# EAGLE design Sensor PCB (EAGLE 9.6.1)
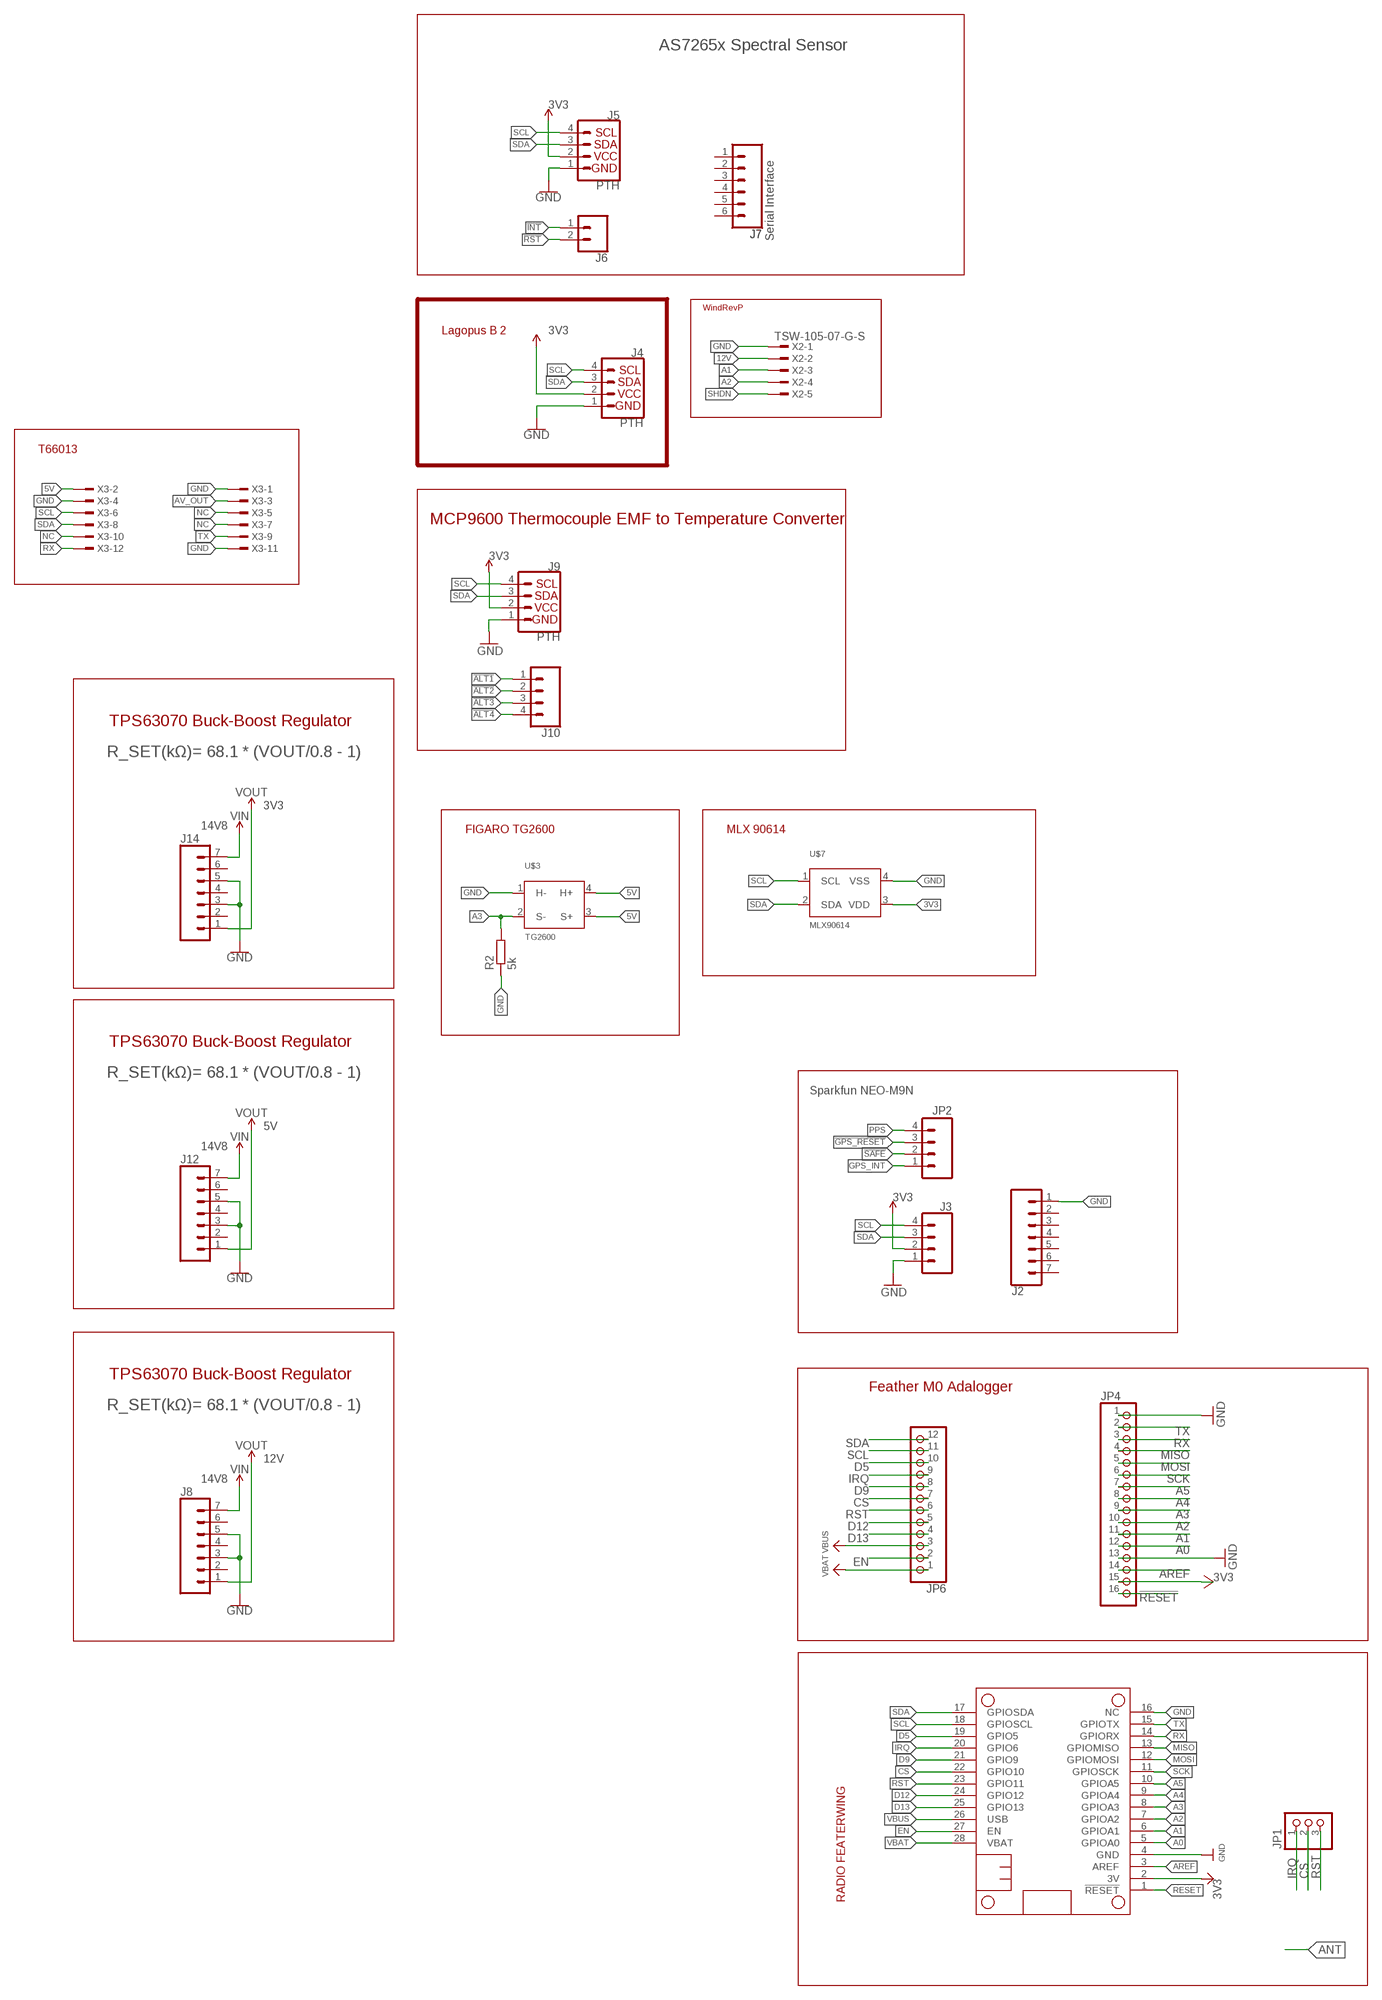
[diagram p0: schematic, sheet 1]

## Parts
J2  CONN_07NO_SILK  [1X07_NO_SILK]
J3  CONN_041X04_NO_SILK  [1X04_NO_SILK]
J4  PTH  I2C_STANDARD_NO_SILK  [1X04_NO_SILK]
J5  PTH  I2C_STANDARD_NO_SILK  [1X04_NO_SILK]
J6  CONN_021X02_NO_SILK  [1X02_NO_SILK]
J7  Serial Interface  CONN_06NO_SILK_FEMALE_PTH  [1X06_NO_SILK]
J8  CONN_07NO_SILK  [1X07_NO_SILK]
J9  PTH  I2C_STANDARD_NO_SILK  [1X04_NO_SILK]
J10  CONN_041X04_NO_SILK  [1X04_NO_SILK]
J12  CONN_07NO_SILK  [1X07_NO_SILK]
J14  CONN_07NO_SILK  [1X07_NO_SILK]
JP1  HEADER-1X376MIL  [1X03_ROUND_76]
JP2  CONN_041X04_NO_SILK  [1X04_NO_SILK]
JP4  HEADER-1X16ROUND  [1X16_ROUND]
JP6  HEADER-1X12  [1X12_ROUND]
MS2  FEATHERWING_NOHOLES  [FEATHERWING_NOHOLES]
R2  5k  R-EU_0207/7  [0207/7]
U$3  TG2600  [TO-5]
U$7  MLX90614  [TO-39]
X2  TSW-105-07-G-S  [TSW-105-XX-G-S]
X3  TSW-106-07-G-D  [TSW-106-XX-G-D]

## Nets
3V3: J3.2 J4.2(VCC) J5.2 J9.2 J14.1 JP4.15 MS2.2(3V) U$7.3(VDD) ; supply symbol labelled 3.3V, +3V3, VOUT
5V: J12.1 U$3.3(S+) U$3.4(H+) X3.2 ; supply symbol labelled VOUT
12V: J8.1 X2.2 ; supply symbol labelled VOUT
14V8: J8.7 J12.7 J14.7 ; supply symbol labelled VIN
!ALT1: J10.1
!ALT2: J10.2
!ALT3: J10.3
!ALT4: J10.4
!GPS_RESET: JP2.3
!INT: J6.1
!RESET: JP4.16
!RST: J6.2
!SAFE: JP2.2
A0: JP4.12 MS2.5(GPIOA0)
A1: JP4.11 MS2.6(GPIOA1) X2.3
A2: JP4.10 MS2.7(GPIOA2) X2.4
A3: JP4.9 MS2.8(GPIOA3) R2.2 U$3.2(S-)
A4: JP4.8 MS2.9(GPIOA4)
A5: JP4.7 MS2.10(GPIOA5)
AREF: JP4.14 MS2.3(AREF)
AV_OUT: X3.3
CS: JP1.2 JP6.7 MS2.22(GPIO10)
D5: JP6.10 MS2.19(GPIO5)
D9: JP6.8 MS2.21(GPIO9)
D12: JP6.5 MS2.24(GPIO12)
D13: JP6.4 MS2.25(GPIO13)
EN: JP6.2 MS2.27(EN)
GND: J2.1 J3.1 J4.1(GND) J5.1 J8.3 J8.5 J9.1 J12.3 J12.5 J14.3 J14.5 JP4.1 JP4.13 MS2.4(GND) MS2.16(NC) R2.1 U$3.1(H-) U$7.4(VSS) X2.1 X3.1 X3.4 X3.11
GPS_INT: JP2.1
IRQ: JP1.1 JP6.9 MS2.20(GPIO6)
MISO: JP4.4 MS2.13(GPIOMISO)
MOSI: JP4.5 MS2.12(GPIOMOSI)
NC: X3.5 X3.7 X3.10
PPS: JP2.4
RESET: MS2.1(!RESET)
RST: JP1.3 JP6.6 MS2.23(GPIO11)
RX: JP4.3 MS2.14(GPIORX) X3.12
SCK: JP4.6 MS2.11(GPIOSCK)
SCL: J3.4 J4.4(SCL) J5.4 J9.4 JP6.11 MS2.18(GPIOSCL) U$7.1(SCL) X3.6
SDA: J3.3 J4.3(SDA) J5.3 J9.3 JP6.12 MS2.17(GPIOSDA) U$7.2(SDA) X3.8
SHDN: X2.5
TX: JP4.2 MS2.15(GPIOTX) X3.9
VBAT: JP6.1 MS2.28(VBAT)
VBUS: JP6.3 MS2.26(USB)
Unconnected: J2.2 J2.3 J2.4 J2.5 J2.6 J2.7 J7.1 J7.2 J7.3 J7.4 J7.5 J7.6 J8.2 J8.4 J8.6 J12.2 J12.4 J12.6 J14.2 J14.4 J14.6

## Notes on the sheet
- AS7265x Spectral Sensor
- WindRevP
- Lagopus B 2
- T66013
- MCP9600 Thermocouple EMF to Temperature Converter
- TPS63070 Buck-Boost Regulator
- R_SET(kΩ)= 68.1 * (VOUT/0.8 - 1)
- FIGARO TG2600 | MLX 90614
- TPS63070 Buck-Boost Regulator
- R_SET(kΩ)= 68.1 * (VOUT/0.8 - 1)
- Sparkfun NEO-M9N
- TPS63070 Buck-Boost Regulator
- Feather M0 Adalogger
- R_SET(kΩ)= 68.1 * (VOUT/0.8 - 1)
- RADIO FEATERWING

## Library data of the parts
J2 J8 J12 J14 = SparkFun-Connectors:CONN_07: Multi connection point. Often used as Generic Header-pin footprint for 0.1 inch spaced/style header connections On any of the 0.1 inch spaced packages, you can populate with these: Break Away Headers - Straight <https://www.sparkfun.com/products/116> (PRT-00116) Break Away Male Headers - Right Angle <https://www.sparkfun.com/products/553> (PRT-00553) Female Headers <https://www.sparkfun.com/products/115> (PRT-00115) Break Away Headers - Machine Pin <https://www.sparkfun.com/products/117> (PRT-00117) Break Away Female Headers - Swiss Machine Pin <https://www.sparkfun.com/products/743> (PRT-00743) For SCREWTERMINALS and SPRING TERMINALS visit here: Screw Terimnals on SparkFun.com <https://www.sparkfun.com/search/results?term=Screw+Terminals> (5mm/3.5mm/2.54mm spacing) This device is also useful as a general connection point to wire up your design to another part of your project. Our various solder wires solder well into these plated through hole pads. Hook-Up Wire - Assortment (Stranded, 22 AWG) <https://www.sparkfun.com/products/11375> (PRT-11375) Hook-Up Wire - Assortment (Solid Core, 22 AWG) <https://www.sparkfun.com/products/11367> (PRT-11367) View the entire wire category on our website here <https://www.sparkfun.com/categories/141> Special notes: Molex polarized connector foot print use with SKU : PRT-08231 with associated crimp pins and housings. 1MM SMD Version SKU: PRT-10208 NOTES ON THE VARIANTS LOCK and LOCK_LONGPADS... This footprint was designed to help hold the alignment of a through-hole component (i.e. 6-pin header) while soldering it into place. You may notice that each hole has been shifted either up or down by 0.005 of an inch from it's more standard position (which is a perfectly straight line). This slight alteration caused the pins (the squares in the middle) to touch the edges of the holes. Because they are alternating, it causes a "brace" to hold the component in place. 0.005 has proven to be the perfect amount of "off-center" position when using our standard breakaway headers. Although looks a little odd when you look at the bare footprint, once you have a header in there, the alteration is very hard to notice. Also,if you push a header all the way into place, it is covered up entirely on the bottom side.
J3 J10 JP2 = SparkFun-Connectors:CONN_04: Multi connection point. Often used as Generic Header-pin footprint for 0.1 inch spaced/style header connections On any of the 0.1 inch spaced packages, you can populate with these: Break Away Headers - Straight <https://www.sparkfun.com/products/116> (PRT-00116) Break Away Male Headers - Right Angle <https://www.sparkfun.com/products/553> (PRT-00553) Female Headers <https://www.sparkfun.com/products/115> (PRT-00115) Break Away Headers - Machine Pin <https://www.sparkfun.com/products/117> (PRT-00117) Break Away Female Headers - Swiss Machine Pin <https://www.sparkfun.com/products/743> (PRT-00743) For SCREWTERMINALS and SPRING TERMINALS visit here: Screw Terimnals on SparkFun.com <https://www.sparkfun.com/search/results?term=Screw+Terminals> (5mm/3.5mm/2.54mm spacing) This device is also useful as a general connection point to wire up your design to another part of your project. Our various solder wires solder well into these plated through hole pads. Hook-Up Wire - Assortment (Stranded, 22 AWG) <https://www.sparkfun.com/products/11375> (PRT-11375) Hook-Up Wire - Assortment (Solid Core, 22 AWG) <https://www.sparkfun.com/products/11367> (PRT-11367) View the entire wire category on our website here <https://www.sparkfun.com/categories/141> Special notes: Molex polarized connector foot print use with SKU : PRT-08231 with associated crimp pins and housings. 1MM SMD Version SKU: PRT-10208; PROD_ID: CONN-09696
J4 = SparkX:I2C_STANDARD: SparkFun I2C Standard Pinout Header SparkFun has standardized on a pinout for all I2C based sensor breakouts. This pinout allows I2C boards to be plugged directly into the headers on Arduino Uno compatible boards, and to be daisy chained easily. Example SparkFun Products: SparkFun Atmospheric Sensor Breakout - BME280 <https://www.sparkfun.com/products/13676> SparkFun Altitude/Pressure Sensor Breakout - MPL3115A2 <https://www.sparkfun.com/products/11084> SparkFun TOF Range Finder Sensor - VL6180 <https://www.sparkfun.com/products/12785>
J5 J9 = SparkFun-Connectors:I2C_STANDARD: SparkFun I2C Standard Pinout Header SparkFun has standardized on a pinout for all I2C based sensor breakouts. This pinout allows I2C boards to be plugged directly into the headers on Arduino Uno compatible boards, and to be daisy chained easily. Example SparkFun Products: SparkFun Atmospheric Sensor Breakout - BME280 <https://www.sparkfun.com/products/13676> SparkFun Altitude/Pressure Sensor Breakout - MPL3115A2 <https://www.sparkfun.com/products/11084> SparkFun TOF Range Finder Sensor - VL6180 <https://www.sparkfun.com/products/12785>
J6 = SparkFun-Connectors:CONN_02: Multi connection point. Often used as Generic Header-pin footprint for 0.1 inch spaced/style header connections On any of the 0.1 inch spaced packages, you can populate with these: Break Away Headers - Straight <https://www.sparkfun.com/products/116> (PRT-00116) Break Away Male Headers - Right Angle <https://www.sparkfun.com/products/553> (PRT-00553) Female Headers <https://www.sparkfun.com/products/115> (PRT-00115) Break Away Headers - Machine Pin <https://www.sparkfun.com/products/117> (PRT-00117) Break Away Female Headers - Swiss Machine Pin <https://www.sparkfun.com/products/743> (PRT-00743) For SCREWTERMINALS and SPRING TERMINALS visit here: Screw Terimnals on SparkFun.com <https://www.sparkfun.com/search/results?term=Screw+Terminals> (5mm/3.5mm/2.54mm spacing) This device is also useful as a general connection point to wire up your design to another part of your project. Our various solder wires solder well into these plated through hole pads. Hook-Up Wire - Assortment (Stranded, 22 AWG) <https://www.sparkfun.com/products/11375> (PRT-11375) Hook-Up Wire - Assortment (Solid Core, 22 AWG) <https://www.sparkfun.com/products/11367> (PRT-11367) View the entire wire category on our website here <https://www.sparkfun.com/categories/141> Special notes: Molex polarized connector foot print use with: PRT-08233 with associated crimp pins and housings. 2.54_SCREWTERM for use with PRT-10571. 3.5mm Screw Terminal footprints for PRT-08084 5mm Screw Terminal footprints for use with PRT-08432
J7 = SparkFun-Connectors:CONN_06: Multi connection point. Often used as Generic Header-pin footprint for 0.1 inch spaced/style header connections On any of the 0.1 inch spaced packages, you can populate with these: Break Away Headers - Straight <https://www.sparkfun.com/products/116> (PRT-00116) Break Away Male Headers - Right Angle <https://www.sparkfun.com/products/553> (PRT-00553) Female Headers <https://www.sparkfun.com/products/115> (PRT-00115) Break Away Headers - Machine Pin <https://www.sparkfun.com/products/117> (PRT-00117) Break Away Female Headers - Swiss Machine Pin <https://www.sparkfun.com/products/743> (PRT-00743) Arduino Stackable Header - 6 Pin <https://www.sparkfun.com/products/9280> (PRT-09280) For SCREWTERMINALS and SPRING TERMINALS visit here: Screw Terimnals on SparkFun.com <https://www.sparkfun.com/search/results?term=Screw+Terminals> (5mm/3.5mm/2.54mm spacing) This device is also useful as a general connection point to wire up your design to another part of your project. Our various solder wires solder well into these plated through hole pads. Hook-Up Wire - Assortment (Stranded, 22 AWG) <https://www.sparkfun.com/products/11375> (PRT-11375) Hook-Up Wire - Assortment (Solid Core, 22 AWG) <https://www.sparkfun.com/products/11367> (PRT-11367) View the entire wire category on our website here <https://www.sparkfun.com/categories/141>; PROD_ID: CONN-08437
JP1 = microbuilder:HEADER-1X3: PIN HEADER
JP4 = microbuilder:HEADER-1X16: PIN HEADER
JP6 = microbuilder:HEADER-1X12
MS2 = microbuilder:FEATHERWING
R2 = rcl:R-EU_: RESISTOR, European symbol; SPICEPREFIX: R
U$3 = Sensor PCB:TG2600
U$7 = Sensor PCB:MLX90614
X2 = con-samtec:TSW-105-*-G-S: THROUGH-HOLE .025" SQ POST HEADER Source: Samtec TSW.pdf; MF: Samtec Inc.; MPN: TSW-105-07-G-S
X3 = con-samtec:TSW-106-*-G: THROUGH-HOLE .025" SQ POST HEADER Source: Samtec TSW.pdf; MF: Samtec Inc.; MPN: TSW-106-07-G-D

## Net classes
1 supply: width 0.584 mm, clearance 0.508 mm
2 3.3V: width 0.508 mm

## Board
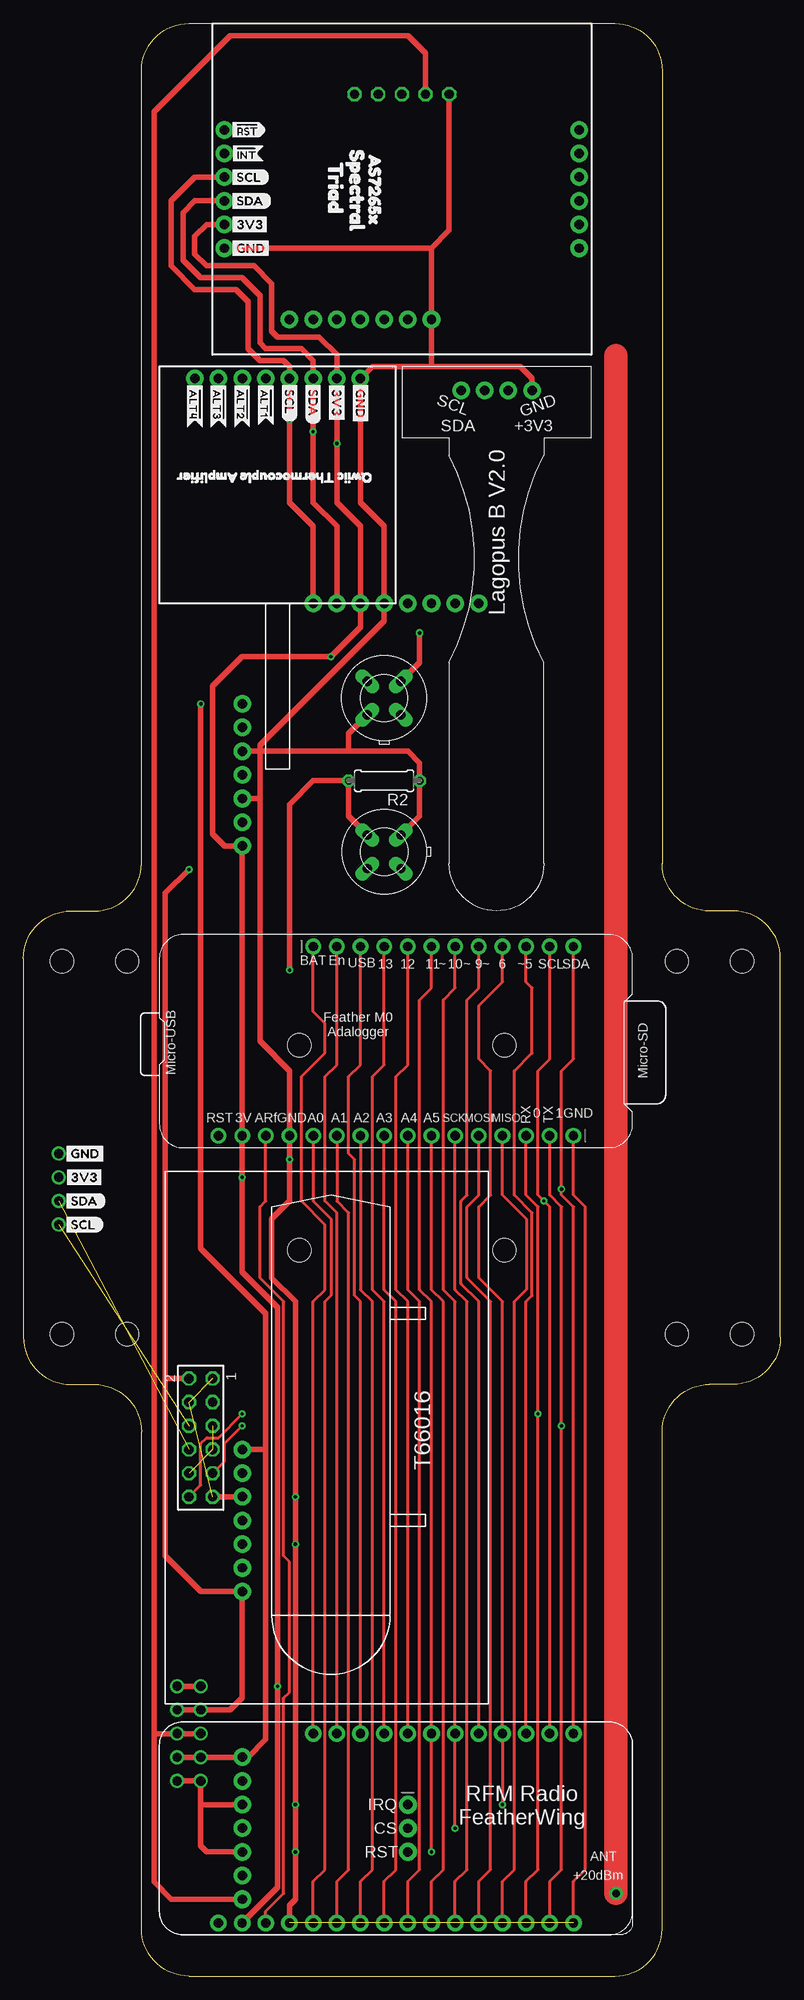
[diagram p1: board, top side]
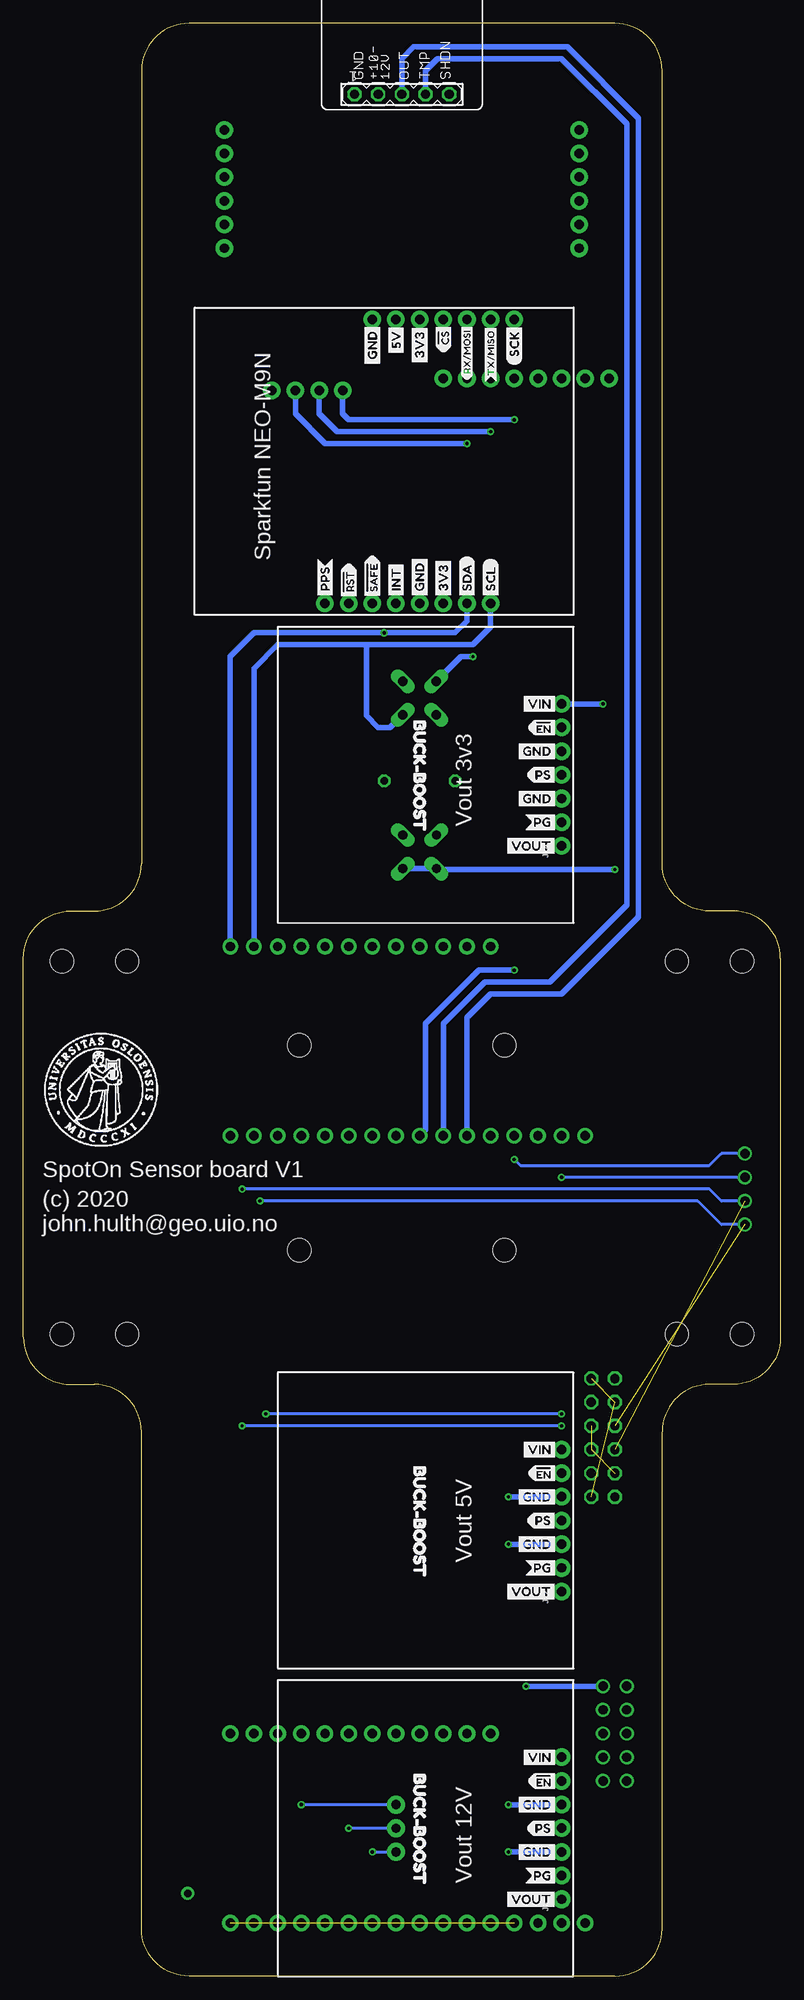
[diagram p2: board, bottom side, seen from below]

Size 81.28 x 209.55 mm. Coordinates in mm from the lower left corner, seen from the top.
Outline: 0,109.22 0,68.58 arc90 5.08,63.5 7.62,63.5 arc-90 12.7,58.42 12.7,5.08 arc90 17.78,0 63.5,0 arc90 68.58,5.08 68.58,58.42 arc-90 73.66,63.5 76.2,63.5 arc90 81.28,68.58 81.28,109.22 arc90 76.2,114.3 73.66,114.3 arc-90 68.58,119.38 68.58,204.47 arc90 63.5,209.55 17.78,209.55 arc90 12.7,204.47 12.7,119.38 arc-90 7.62,114.3 5.08,114.3 arc90 0,109.22
Copper layers (1*16): Top 0.035mm / dielectric 1.5mm / Bottom 0.035mm
Design rules "default": minimum track width 6mil, minimum drill 0.35mm, track to track 6mil, track to pad 6mil, pad to pad 6mil, via to via 6mil, smd to smd 6mil, copper to edge 40mil, drill to drill 6mil, minimum pad ring 10mil, minimum via ring 8mil, stop-mask expansion 4mil, vias tented up to drill 0mil, thermal gap 10mil
Holes 2.5 mm at 29.64,77.9 51.64,77.9 51.64,99.9 29.64,99.9 4.14,68.9 11.14,68.9 4.14,108.9 11.14,108.9 77.14,108.9 70.14,108.9 70.14,68.9 77.14,68.9

### Footprints (pad centres in the part's own frame; a part is rotated, then mirrored left to right if it is on the bottom)
1X07_NO_SILK = drill 1.016 pad 1.88: 1 0,0; 2 2.54,0; 3 5.08,0; 4 7.62,0; 5 10.16,0; 6 12.7,0; 7 15.24,0
1X04_NO_SILK = drill 1.016 pad 1.88: 1 0,0; 2 2.54,0; 3 5.08,0; 4 7.62,0
1X02_NO_SILK = drill 1.016 pad 1.88: 1 0,0; 2 2.54,0
1X06_NO_SILK = drill 1.016 pad 1.88: 1 0,0; 2 2.54,0; 3 5.08,0; 4 7.62,0; 5 10.16,0; 6 12.7,0
1X03_ROUND_76 = drill 1 pad 1.93: 1 -2.54,0; 2 0,0; 3 2.54,0
1X16_ROUND = drill 1 pad 1.676: 1 -19.05,0; 2 -16.51,0; 3 -13.97,0; 4 -11.43,0; 5 -8.89,0; 6 -6.35,0; 7 -3.81,0; 8 -1.27,0; 9 1.27,0; 10 3.81,0; 11 6.35,0; 12 8.89,0; 13 11.43,0; 14 13.97,0; 15 16.51,0; 16 19.05,0
1X12_ROUND = drill 1 pad 1.676: 1 -13.97,0; 2 -11.43,0; 3 -8.89,0; 4 -6.35,0; 5 -3.81,0; 6 -1.27,0; 7 1.27,0; 8 3.81,0; 9 6.35,0; 10 8.89,0; 11 11.43,0; 12 13.97,0
FEATHERWING_NOHOLES = drill 1 pad 1.778: 1 6.35,1.27; 2 8.89,1.27; 3 11.43,1.27; 4 13.97,1.27; 5 16.51,1.27; 6 19.05,1.27; 7 21.59,1.27; 8 24.13,1.27; 9 26.67,1.27; 10 29.21,1.27; 11 31.75,1.27; 12 34.29,1.27; 13 36.83,1.27; 14 39.37,1.27; 15 41.91,1.27; 16 44.45,1.27; 17 44.45,21.59; 18 41.91,21.59; 19 39.37,21.59; 20 36.83,21.59; 21 34.29,21.59; 22 31.75,21.59; 23 29.21,21.59; 24 26.67,21.59; 25 24.13,21.59; 26 21.59,21.59; 27 19.05,21.59; 28 16.51,21.59
0207/7 = drill 0.813 octagon: 1 -3.81,0; 2 3.81,0
TO-5 = drill 1 long: 1 -1.8,1.8; 2 -1.8,-1.8; 3 1.8,-1.8; 4 1.8,1.8
TO-39 = drill 1 long: 1 -1.796,1.796; 2 -1.796,-1.796; 3 1.796,-1.796; 4 1.796,1.796
TSW-105-XX-G-S = drill 1 pad 1.5 octagon: 1 5.08,0; 2 2.54,0; 3 0,0; 4 -2.54,0; 5 -5.08,0
TSW-106-XX-G-D = drill 1 pad 1.5 octagon: 1 6.35,-1.27; 2 6.35,1.27; 3 3.81,-1.27; 4 3.81,1.27; 5 1.27,-1.27; 6 1.27,1.27; 7 -1.27,-1.27; 8 -1.27,1.27; 9 -3.81,-1.27; 10 -3.81,1.27; 11 -6.35,-1.27; 12 -6.35,1.27

### Placement (x,y rotation side)
J2  43.81,177.8 0 bottom
J3  38.73,147.32 0 bottom
J4  54.61,170.18 180 top
J5  21.59,185.42 90 top
J6  21.59,195.58 90 top
J7  59.69,185.42 90 top
J8  23.5,8.26 90 bottom
J9  36.2,171.45 180 top
J10  26.04,171.45 180 top
J12  23.5,41.28 90 bottom
J14  23.5,121.28 90 bottom
JP1  41.27,15.88 270 top
JP2  41.27,147.32 180 bottom
JP4  40.01,90.17 180 top
JP6  45.09,110.49 0 top
MS2  14.61,4.45 0 top
R2  38.73,128.27 180 top
U$1  [UIO-LOGO-BL]  79.25,88.77 0 bottom
U$3  38.73,120.65 270 top
U$7  38.73,137.16 180 top
U$8  [GND-04]  4.19,88.27 0 top
U$9  [SDA-[)]  33.66,147.7 90 bottom
U$10  [SCL-[)]  31.12,147.7 90 bottom
U$11  [3V3-04]  36.2,147.7 90 bottom
U$12  [GND-04]  38.73,147.7 90 bottom
U$13  [INT8]  41.27,147.7 90 bottom
U$14  [#RST3]  46.36,147.45 90 bottom
U$15  [3V3-04]  4.19,85.73 0 top
U$16  [#SAFE1]  43.81,147.45 90 bottom
U$17  [PPS5]  48.9,147.7 90 bottom
U$18  [3V3-04]  38.73,172.69 90 bottom
U$19  [SDA-[)]  4.19,83.19 0 top
U$20  [GND-04]  43.81,172.57 90 bottom
U$21  [5V]  41.27,173.71 90 bottom
U$22  [CS#-<]]  36.17,173.96 90 bottom
U$23  [AS7265X0]  37.72,196.6 270 top
U$24  [SCK-(]-04]  28.58,172.85 90 bottom
U$25  [RX#MOSI2]  33.66,171.22 90 bottom
U$26  [SCL-[)]  4.19,80.65 0 top
U$27  [TX#MISO0]  31.09,171.04 90 bottom
U$29  [VIN0]  28.07,23.5 0 bottom
U$30  [GND1]  28.58,18.42 0 bottom
U$31  [GND0]  36.2,171.2 270 top
U$32  [3V31]  33.66,171.2 270 top
U$33  [SDA2]  31.12,171.2 270 top
U$34  [SCL3]  28.58,171.2 270 top
U$35  [#ALT14]  26.04,171.32 270 top
U$36  [SPECTRAL1]  35.81,197.36 270 top
U$37  [TRIAD2]  33.53,195.96 270 top
U$38  [#ALT25]  23.5,171.32 270 top
U$39  [#ALT36]  20.96,171.32 270 top
U$40  [#ALT47]  18.41,171.32 270 top
U$41  [QWIIC_THERMOCOUPLE2]  38.35,160.78 180 top
U$42  [AMPLIFIER1]  23.88,160.78 180 top
U$43  [GND1]  28.58,13.34 0 bottom
U$44  [GND-04]  21.97,185.42 0 top
U$45  [3V3-04]  21.97,187.96 0 top
U$46  [SDA-[)]  21.97,190.5 0 top
U$47  [SCL-[)]  21.97,193.04 0 top
U$48  [INT#-[<-04]  21.84,195.58 0 top
U$49  [RST#-[>-04]  21.84,198.12 0 top
U$50  [VOUT2]  29.84,8.26 0 bottom
U$51  [#EN0]  27.3,20.96 0 bottom
U$52  [PS1]  27.3,15.88 0 bottom
U$53  [PG2]  27.43,10.8 0 bottom
U$54  [BUCK#BOOST18]  38.73,22.86 270 bottom
U$63  [VIN0]  28.07,56.52 0 bottom
U$64  [GND1]  28.58,51.44 0 bottom
U$65  [GND1]  28.58,46.36 0 bottom
U$66  [VOUT2]  29.84,41.28 0 bottom
U$67  [#EN0]  27.3,53.98 0 bottom
U$68  [PS1]  27.3,48.9 0 bottom
U$69  [PG2]  27.43,43.82 0 bottom
U$70  [BUCK#BOOST18]  38.73,55.88 270 bottom
U$79  [VIN0]  28.07,136.53 0 bottom
U$80  [GND1]  28.58,131.44 0 bottom
U$81  [GND1]  28.58,126.37 0 bottom
U$82  [VOUT2]  29.84,121.28 0 bottom
U$83  [#EN0]  27.3,133.99 0 bottom
U$84  [PS1]  27.3,128.91 0 bottom
U$85  [PG2]  27.43,123.83 0 bottom
U$86  [BUCK#BOOST18]  38.73,135.89 270 bottom
X2  40.64,201.93 180 bottom
X3  19.05,57.79 90 top

### Tracks (layer width: path | path; a pad name or v marks a point on that pad's centre or on a via)
3V3  (via drill 0.35, 1)
  Top 0.61: MS2.2 27.3,9.53 v27.3,31.12 27.3,71.76 23.5,75.56 v23.5,85.73 JP4.15 J14.1 21.59,121.28 20.32,122.56 20.32,138.43 23.5,141.61 v33.02,141.61 36.2,144.78 J3.2 36.2,155.57 33.66,158.12 v33.66,164.47 J9.2 33.66,173.99 31.75,175.9 27.3,175.9 26.67,176.53 26.67,181.61 24.77,183.51 19.69,183.51 18.41,184.79 18.41,186.69 19.69,187.96 J5.2 | v16.51,31.12 v19.05,31.12
  Bottom 0.305: v3.81,85.73 v23.5,85.73
  Bottom 0.61: J4.2 52.07,167.64 48.9,164.47 v33.66,164.47 | v19.05,31.12 v27.3,31.12 | U$7.3 34.29,141.61 v33.02,141.61
5V  (via drill 0.35, 1)
  Top 0.61: X3.2 15.24,64.14 | 15.24,64.14 15.24,45.09 19.05,41.28 J12.1 23.5,29.85 22.23,28.58 v19.05,28.58 v16.51,28.58 | v17.78,118.75 15.24,116.21 15.24,64.14
  Bottom 0.61: v17.78,118.75 36.83,118.75 U$3.3 U$3.4
12V  (via drill 1)
  Top 0.61: J8.1 15.88,8.26 14.02,10.11 14.02,26.04 | 14.02,26.04 v16.51,26.04 v19.05,26.04 | X2.2 43.18,206.32 41.27,208.23 22.17,208.23 14.02,200.08 14.02,26.04
14V8  (via drill 0.35, 1)
  Top 0.61: 26.04,56.52 26.04,25.4 24.13,23.5 J8.7 v19.05,23.5 v16.51,23.5 | J12.7 26.04,56.52 | v19.05,136.53 19.05,78.11 26.04,71.12 26.04,56.52
  Bottom 0.61: v19.05,136.53 J14.7
A0
  Top 0.305: MS2.5 31.12,10.16 32.38,11.43 32.38,72.39 33.02,73.03 33.02,81.28 31.12,83.19 JP4.12
A1
  Top 0.305: MS2.6 33.66,10.16 34.92,11.43 34.92,81.92 33.66,83.19 JP4.11
  Bottom 0.61: X2.3 40.64,205.74 39.37,207.01 22.86,207.01 15.24,199.39 15.24,113.67 23.5,105.41 31.12,105.41 33.66,102.87 JP4.11
A2
  Top 0.305: MS2.7 36.2,10.16 37.47,11.43 37.47,72.39 36.2,73.66 JP4.10
  Bottom 0.61: JP4.10 36.2,102.24 31.75,106.68 24.77,106.68 16.51,114.94 16.51,198.75 23.5,205.74 36.83,205.74 38.1,204.47 X2.4
A3  (via drill 0.35)
  Top 0.305: MS2.8 38.73,10.16 40.01,11.43 40.01,72.39 38.73,73.66 JP4.9
  Top 0.61: U$3.2 34.92,124.46 R2.2 31.12,128.27 28.58,125.73 v28.58,107.95
  Bottom 0.61: JP4.9 38.1,90.81 38.1,102.24 32.38,107.95 v28.58,107.95
A4
  Top 0.305: MS2.9 41.27,10.16 42.55,11.43 42.55,72.39 41.27,73.66 JP4.8
A5
  Top 0.305: MS2.10 43.81,10.16 45.09,11.43 45.09,72.39 43.81,73.66 JP4.7
ANT  (via drill 0.8 pad 1.42)
  Top 2.54: v63.63,8.89 63.63,173.86
AREF
  Top 0.305: MS2.3 26.04,6.98 27.94,8.89 27.94,29.85 28.58,30.48 28.58,44.45 27.94,45.09 27.94,72.39 25.4,74.93 25.4,82.55 26.04,83.19 JP4.14
CS  (via drill 0.35)
  Top 0.305: v46.36,15.88 MS2.22 46.36,72.39 45.09,73.66 45.09,104.78 46.36,106.05 JP6.7
  Bottom 0.305: JP1.2 v46.36,15.88
D5
  Top 0.305: MS2.19 53.98,72.39 54.61,73.03 54.61,81.92 52.7,83.82 52.7,97.16 54.61,99.06 54.61,106.05 53.98,106.68 JP6.10
D9
  Top 0.305: MS2.21 48.9,72.39 46.99,74.3 46.99,83.19 47.62,83.82 47.62,104.78 48.9,106.05 JP6.8
D12
  Top 0.305: MS2.24 41.27,72.39 40.01,73.66 40.01,96.52 41.27,97.79 JP6.5
D13
  Top 0.305: MS2.25 38.73,72.39 37.47,73.66 37.47,96.52 38.73,97.79 JP6.4
EN
  Top 0.305: MS2.27 33.66,81.92 32.38,83.19 32.38,96.52 33.66,97.79 JP6.2
GND  (via drill 0.35, 1)  (3 unrouted)
  Top 0.305: MS2.16 59.05,10.16 60.33,11.43 60.33,82.55 59.05,83.82 JP4.1
  Top 0.61: J8.5 19.05,18.42 | J8.3 19.69,13.34 19.05,13.97 19.05,18.42 | X3.11 J12.5 | MS2.4 28.58,7.62 29.21,8.26 v29.21,13.34 v29.21,18.42 v29.21,46.36 v29.21,51.44 29.21,72.39 26.67,74.93 26.67,81.28 28.58,83.19 v28.58,87.63 JP4.13 28.58,97.16 25.4,100.33 25.4,126.37 | 25.4,126.37 J14.3 | 25.4,126.37 25.4,131.44 | 25.4,131.44 J14.5 | 25.4,131.44 25.4,132.08 38.73,145.42 J3.1 38.73,155.57 36.2,158.12 J9.1 37.47,172.72 43.81,172.72 | J5.1 43.81,185.42 | 43.81,185.42 | J2.1 | J2.1 43.81,185.42 | 43.81,185.42 45.72,187.32 X2.1 | J4.1 54.61,171.45 53.34,172.72 43.81,172.72 | J2.1 43.81,172.72 | v16.51,20.96 v19.05,20.96 19.05,18.42 | 25.4,131.44 34.92,131.44 | 34.92,131.44 41.27,131.44 42.55,130.18 R2.1 42.55,124.46 U$3.1 | 34.92,131.44 34.92,133.35 U$7.4
  Bottom 0.305: v3.81,88.27 6.35,88.27 7.62,87 27.94,87 v28.58,87.63
  Bottom 0.61: J8.3 v29.21,13.34 | J8.5 v29.21,18.42 | J12.3 v29.21,46.36 | J12.5 v29.21,51.44 | J5.1
IRQ  (via drill 0.35)
  Top 0.305: v51.44,18.42 MS2.20 51.44,72.39 48.9,74.93 48.9,82.55 50.16,83.82 50.16,97.16 48.9,98.43 48.9,104.14 51.44,106.68 JP6.9
  Bottom 0.305: JP1.1 v51.44,18.42
MISO
  Top 0.305: MS2.13 51.44,10.16 52.7,11.43 52.7,72.39 54.06,73.74 54.06,81.2 51.44,83.82 JP4.4
MOSI
  Top 0.305: MS2.12 48.9,10.16 50.16,11.43 50.16,72.39 47.62,74.93 47.62,82.55 48.9,83.82 JP4.5
NC  (2 unrouted)
RST  (via drill 0.35)
  Top 0.305: JP6.6 43.81,106.05 42.55,104.78 42.55,73.66 43.81,72.39 MS2.23 v43.81,13.34
  Bottom 0.305: v43.81,13.34 JP1.3
RX  (via drill 0.35)
  Top 0.305: X3.12 19.05,52.71 19.05,57.15 19.69,57.79 20.96,57.79 v23.5,60.33 | MS2.14 53.98,10.16 55.25,11.43 v55.25,60.33 55.25,82.55 53.98,83.82 JP4.3
  Bottom 0.305: v23.5,60.33 v55.25,60.33
SCK
  Top 0.305: MS2.11 46.36,10.16 47.62,11.43 47.62,72.39 46.36,73.66 JP4.6
SCL  (via drill 0.35, 1)  (1 unrouted)
  Top 0.305: JP6.11 56.52,98.43 55.25,97.16 55.25,83.82 v55.88,83.19 56.52,82.55 MS2.18
  Top 0.61: J5.4 18.41,193.04 15.88,190.5 15.88,183.51 18.41,180.98 22.86,180.98 24.13,179.71 24.13,174.62 25.4,173.36 27.94,173.36 28.58,172.72 J9.4 v28.58,167 28.58,158.12 31.12,155.57 J3.4
  Bottom 0.305: v3.81,80.65 6.35,80.65 8.89,83.19 v55.88,83.19
  Bottom 0.61: J4.4 46.99,167.64 46.36,167 v28.58,167 | JP6.11 56.52,140.34 53.98,142.88 44.45,142.88 | J3.4 31.12,144.78 33.02,142.88 44.45,142.88 | U$7.1 41.91,133.99 43.18,133.99 44.45,135.25 44.45,142.88
SDA  (via drill 0.35, 1)  (1 unrouted)
  Top 0.305: MS2.17 59.05,82.55 57.78,83.82 v57.78,84.46 57.78,97.16 59.05,98.43 JP6.12
  Top 0.61: J5.3 18.41,190.5 17.14,189.23 17.14,184.15 19.05,182.25 23.5,182.25 25.4,180.34 25.4,175.26 26.04,174.62 29.84,174.62 31.12,173.36 J9.3 v31.12,165.74 31.12,158.12 33.66,155.57 J3.3 | U$7.2 42.55,140.97 v42.55,144.15
  Bottom 0.305: v3.81,83.19 6.35,83.19 7.62,84.46 v57.78,84.46
  Bottom 0.61: J4.3 49.53,167.64 47.62,165.74 v31.12,165.74 | J3.3 33.66,145.42 34.92,144.15 v42.55,144.15 56.52,144.15 59.05,141.61 JP6.12
TX  (via drill 0.35)
  Top 0.305: X3.9 21.59,55.25 21.59,57.15 v23.5,59.06 | MS2.15 56.52,10.16 57.78,11.43 v57.78,59.06 57.78,82.55 56.52,83.82 JP4.2
  Bottom 0.305: v23.5,59.06 v57.78,59.06
VBAT
  Top 0.305: MS2.28 31.12,72.39 32.38,73.66 32.38,80.63 29.84,83.17 29.84,96.52 32.38,99.06 32.38,102.24 31.12,103.51 JP6.1
VBUS
  Top 0.305: MS2.26 36.2,72.39 35.56,73.03 35.56,87.63 34.92,88.27 34.92,96.52 36.2,97.79 JP6.3

### Text on the board
tPlace: BAT | En | USB | 13 | 12 | 11 | ~ | 10 | ~ | 9 | ~ | 6 | ~5 | SCL | SDA | Feather M0 / Adalogger | Micro-USB | Micro-SD | RX | 0 | TX | 1 | GND | RST | 3V | ARf | GND | A0 | A1 | A2 | A3 | A4 | A5 | SCK | MOSI | MISO | T66016 | IRQ | RFM Radio / FeatherWing | CS | RST | ANT | +20dBm
bPlace: Sparkfun NEO-M9N | Vout 3v3 | SpotOn Sensor board V1 | (c) 2020 / john.hulth@geo.uio.no | Vout 5V | Vout 12V
tNames: SCL | GND | SDA | +3V3 | Lagopus B V2.0
tValues: MLX90614 | TG2600